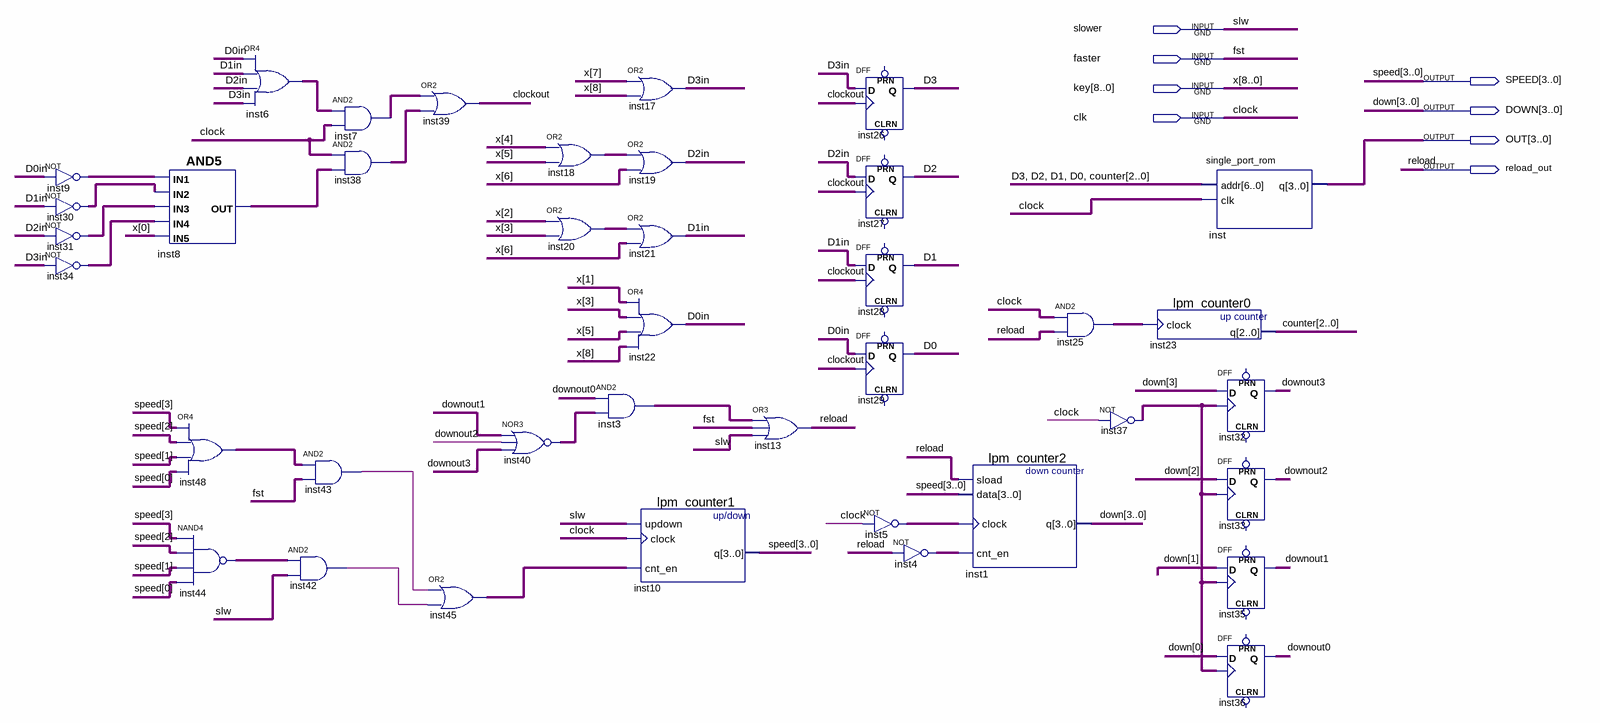
[diagram p0: schematic sheet]
// Quartus schematic sapr2.bdf as structural Verilog: 39 symbols, 8 pins
module sapr2 (
  input  slower,
  input  faster,
  input  [8:0] key,
  input  clk,
  output [3:0] SPEED,
  output [3:0] DOWN,
  output [3:0] OUT,
  output reload_out
);

  wire clockout, D0, D0in, D1, D1in, D2, D2in, D3, D3in, downout0, downout1, downout2, downout3, inst3_out,
       inst4_out, inst5_out, inst6_out, inst7_out, inst8_out, inst9_out, inst18_out, inst20_out, inst25_out,
       inst30_out, inst31_out, inst34_out, inst37_out, inst38_out, inst40_out, inst42_out, inst43_out,
       inst44_out, inst45_out, inst48_out;
  wire [2:0] counter;

  not inst9 (inst9_out, D0in);
  not inst30 (inst30_out, D1in);
  not inst31 (inst31_out, D2in);
  not inst34 (inst34_out, D3in);
  and inst8 (inst8_out, inst9_out, inst30_out, inst31_out, inst34_out, key[0]);
  or inst48 (inst48_out, SPEED[3], SPEED[2], SPEED[1], SPEED[0]);
  nand inst44 (inst44_out, SPEED[3], SPEED[2], SPEED[1], SPEED[0]);
  or inst6 (inst6_out, D0in, D1in, D2in, D3in);
  and inst7 (inst7_out, inst6_out, clk);
  and inst38 (inst38_out, clk, inst8_out);
  and inst43 (inst43_out, inst48_out, faster);
  and inst42 (inst42_out, inst44_out, slower);
  or inst39 (clockout, inst7_out, inst38_out);
  or inst45 (inst45_out, inst43_out, inst42_out);
  nor inst40 (inst40_out, downout1, downout2, downout3);
  or inst18 (inst18_out, key[4], key[5]);
  or inst20 (inst20_out, key[2], key[3]);
  or inst17 (D3in, key[7], key[8]);
  or inst19 (D2in, inst18_out, key[6]);
  or inst21 (D1in, inst20_out, key[6]);
  or inst22 (D0in, key[1], key[3], key[5], key[8]);
  and inst3 (inst3_out, downout0, inst40_out);
  lpm_counter1 inst10 (.updown(slower), .clock(clk), .cnt_en(inst45_out), .q(SPEED));
  or inst13 (reload_out, inst3_out, faster, slower);
  DFF inst26 (.CLK(clockout), .D(D3in), .Q(D3));  // open: CLRN, PRN
  DFF inst27 (.CLK(clockout), .D(D2in), .Q(D2));  // open: CLRN, PRN
  DFF inst28 (.CLK(clockout), .D(D1in), .Q(D1));  // open: CLRN, PRN
  DFF inst29 (.CLK(clockout), .D(D0in), .Q(D0));  // open: CLRN, PRN
  not inst5 (inst5_out, clk);
  not inst4 (inst4_out, reload_out);
  lpm_counter2 inst1 (.sload(reload_out), .data(SPEED), .clock(inst5_out), .cnt_en(inst4_out), .q(DOWN));
  and inst25 (inst25_out, clk, reload_out);
  not inst37 (inst37_out, clk);
  lpm_counter0 inst23 (.clock(inst25_out), .q(counter));
  single_port_rom inst (.addr({D3, D2, D1, D0, counter}), .clk(clk), .q(OUT));
  DFF inst32 (.CLK(inst37_out), .D(DOWN[3]), .Q(downout3));  // open: CLRN, PRN
  DFF inst33 (.CLK(inst37_out), .D(DOWN[2]), .Q(downout2));  // open: CLRN, PRN
  DFF inst35 (.CLK(inst37_out), .D(DOWN[1]), .Q(downout1));  // open: CLRN, PRN
  DFF inst36 (.CLK(inst37_out), .D(DOWN[0]), .Q(downout0));  // open: CLRN, PRN

  // Other names for the same wires on the sheet: clock = clk; fst = faster; reload = reload_out; slw = slower;
  //   x[8:0] = key
endmodule
